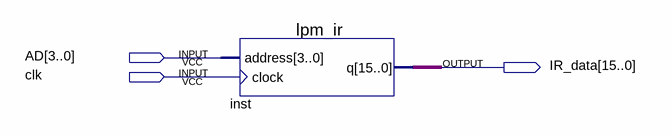
[diagram p0: schematic sheet]
// Quartus schematic ROM_instruction.bdf as structural Verilog: 1 symbols, 3 pins
module ROM_instruction (
  input  [3:0] AD,
  input  clk,
  output [15:0] IR_data
);

  lpm_ir inst (.address(AD), .clock(clk), .q(IR_data));
endmodule
